# EAGLE board board (EAGLE 9.5.2), part 1 of 2
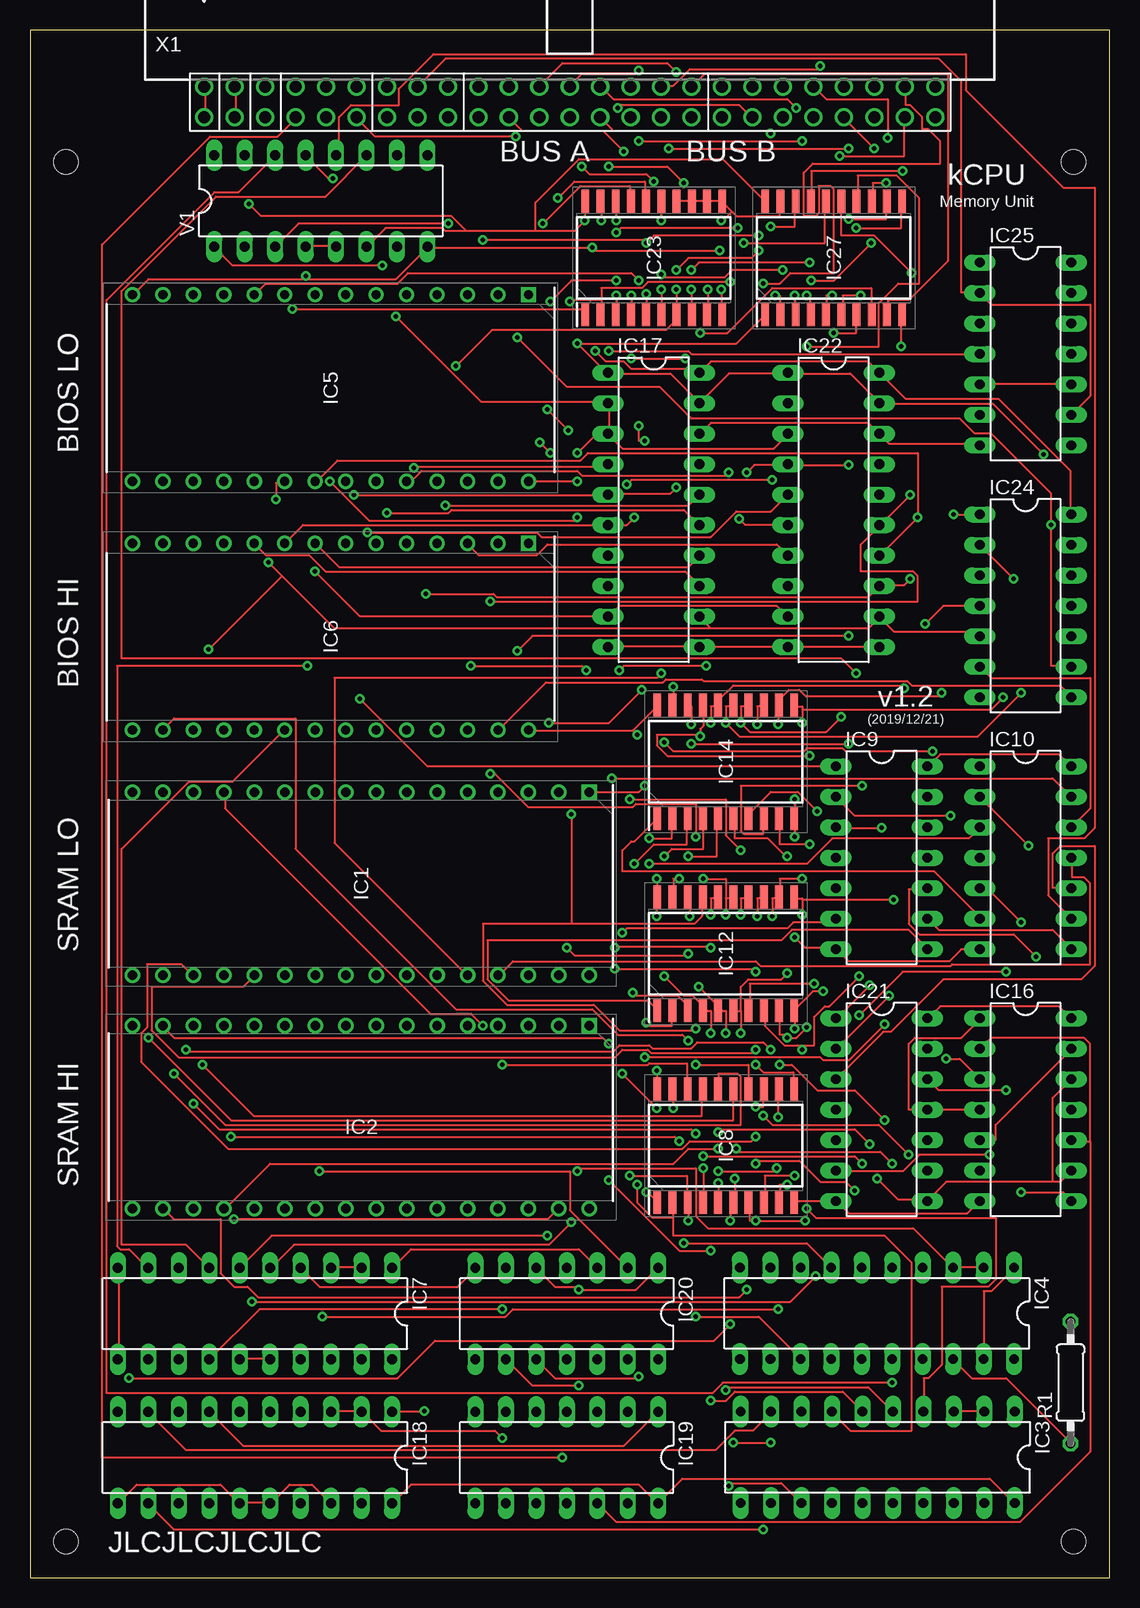
[diagram p3: board, top side]
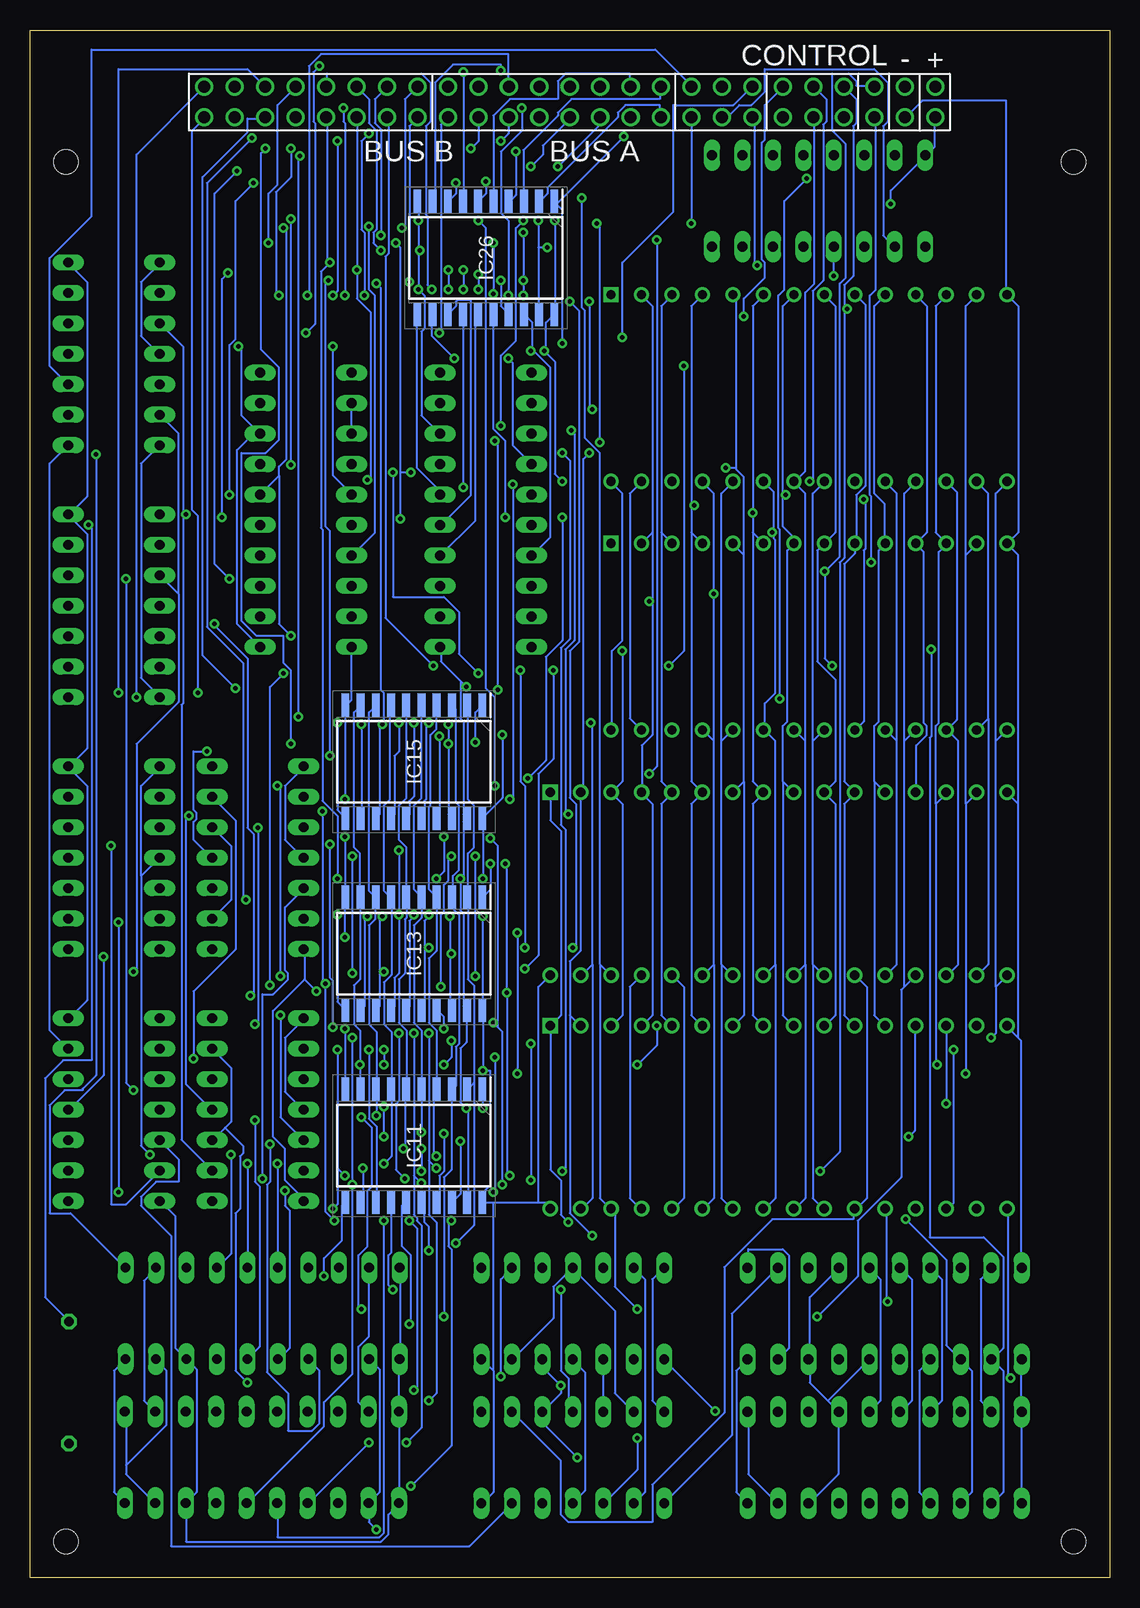
[diagram p4: board, bottom side, seen from below]

Size 90 x 129 mm. Coordinates in mm from the lower left corner, seen from the top.
Outline: 0,0 90,0 90,129 0,129 0,0
Copper layers (1*16): Top 0.035mm / dielectric 1.5mm / Bottom 0.035mm
Design rules "default": minimum track width 6mil, minimum drill 0.35mm, track to track 6mil, track to pad 6mil, pad to pad 6mil, via to via 6mil, smd to smd 6mil, copper to edge 40mil, drill to drill 6mil, minimum pad ring 10mil, minimum via ring 8mil, stop-mask expansion 4mil, vias tented up to drill 0mil, thermal gap 10mil
Holes 2 mm at 3,118 87,118 3,3 87,3

## Footprints (pad centres in the part's own frame; a part is rotated, then mirrored left to right if it is on the bottom)
DIP1524W58P254L4191H406Q32N = drill 0.784 pad 1.184 square: 1 -7.62,19.05 | drill 0.784 pad 1.184: 2 -7.62,16.51; 3 -7.62,13.97; 4 -7.62,11.43; 5 -7.62,8.89; 6 -7.62,6.35; 7 -7.62,3.81; 8 -7.62,1.27; 9 -7.62,-1.27; 10 -7.62,-3.81; 11 -7.62,-6.35; 12 -7.62,-8.89; 13 -7.62,-11.43; 14 -7.62,-13.97; 15 -7.62,-16.51; 16 -7.62,-19.05; 17 7.62,-19.05; 18 7.62,-16.51; 19 7.62,-13.97; 20 7.62,-11.43; 21 7.62,-8.89; 22 7.62,-6.35; 23 7.62,-3.81; 24 7.62,-1.27; 25 7.62,1.27; 26 7.62,3.81; 27 7.62,6.35; 28 7.62,8.89; 29 7.62,11.43; 30 7.62,13.97; 31 7.62,16.51; 32 7.62,19.05
DIL20 = drill 0.813 long: 1 -11.43,-3.81; 2 -8.89,-3.81; 3 -6.35,-3.81; 4 -3.81,-3.81; 5 -1.27,-3.81; 6 1.27,-3.81; 7 3.81,-3.81; 8 6.35,-3.81; 9 8.89,-3.81; 10 11.43,-3.81; 11 11.43,3.81; 12 8.89,3.81; 13 6.35,3.81; 14 3.81,3.81; 15 1.27,3.81; 16 -1.27,3.81; 17 -3.81,3.81; 18 -6.35,3.81; 19 -8.89,3.81; 20 -11.43,3.81
DIP1556W56P254L3702H483Q28N = drill 0.759 pad 1.159 square: 1 -7.779,16.51 | drill 0.759 pad 1.159: 2 -7.779,13.97; 3 -7.779,11.43; 4 -7.779,8.89; 5 -7.779,6.35; 6 -7.779,3.81; 7 -7.779,1.27; 8 -7.779,-1.27; 9 -7.779,-3.81; 10 -7.779,-6.35; 11 -7.779,-8.89; 12 -7.779,-11.43; 13 -7.779,-13.97; 14 -7.779,-16.51; 15 7.779,-16.51; 16 7.779,-13.97; 17 7.779,-11.43; 18 7.779,-8.89; 19 7.779,-6.35; 20 7.779,-3.81; 21 7.779,-1.27; 22 7.779,1.27; 23 7.779,3.81; 24 7.779,6.35; 25 7.779,8.89; 26 7.779,11.43; 27 7.779,13.97; 28 7.779,16.51
SOIC127P1030X265-20N = smd 1.95 x 0.65: 1 -4.725,5.715; 2 -4.725,4.445; 3 -4.725,3.175; 4 -4.725,1.905; 5 -4.725,0.635; 6 -4.725,-0.635; 7 -4.725,-1.905; 8 -4.725,-3.175; 9 -4.725,-4.445; 10 -4.725,-5.715; 11 4.725,-5.715; 12 4.725,-4.445; 13 4.725,-3.175; 14 4.725,-1.905; 15 4.725,-0.635; 16 4.725,0.635; 17 4.725,1.905; 18 4.725,3.175; 19 4.725,4.445; 20 4.725,5.715
DIL14 = drill 0.813 long: 1 -7.62,-3.81; 2 -5.08,-3.81; 3 -2.54,-3.81; 4 0,-3.81; 5 2.54,-3.81; 6 5.08,-3.81; 7 7.62,-3.81; 8 7.62,3.81; 9 5.08,3.81; 10 2.54,3.81; 11 0,3.81; 12 -2.54,3.81; 13 -5.08,3.81; 14 -7.62,3.81
0207/10 = drill 0.813 octagon: 1 -5.08,0; 2 5.08,0
DIL16 = drill 0.813 long: 1 -8.89,-3.81; 2 -6.35,-3.81; 3 -3.81,-3.81; 4 -1.27,-3.81; 5 1.27,-3.81; 6 3.81,-3.81; 7 6.35,-3.81; 8 8.89,-3.81; 9 8.89,3.81; 10 6.35,3.81; 11 3.81,3.81; 12 1.27,3.81; 13 -1.27,3.81; 14 -3.81,3.81; 15 -6.35,3.81; 16 -8.89,3.81
PAK100/2500-5-50 = drill 1 pad 1.422: 1 -30.48,-1.27; 2 -30.48,1.27; 3 -27.94,-1.27; 4 -27.94,1.27; 5 -25.4,-1.27; 6 -25.4,1.27; 7 -22.86,-1.27; 8 -22.86,1.27; 9 -20.32,-1.27; 10 -20.32,1.27; 11 -17.78,-1.27; 12 -17.78,1.27; 13 -15.24,-1.27; 14 -15.24,1.27; 15 -12.7,-1.27; 16 -12.7,1.27; 17 -10.16,-1.27; 18 -10.16,1.27; 19 -7.62,-1.27; 20 -7.62,1.27; 21 -5.08,-1.27; 22 -5.08,1.27; 23 -2.54,-1.27; 24 -2.54,1.27; 25 0,-1.27; 26 0,1.27; 27 2.54,-1.27; 28 2.54,1.27; 29 5.08,-1.27; 30 5.08,1.27; 31 7.62,-1.27; 32 7.62,1.27; 33 10.16,-1.27; 34 10.16,1.27; 35 12.7,-1.27; 36 12.7,1.27; 37 15.24,-1.27; 38 15.24,1.27; 39 17.78,-1.27; 40 17.78,1.27; 41 20.32,-1.27; 42 20.32,1.27; 43 22.86,-1.27; 44 22.86,1.27; 45 25.4,-1.27; 46 25.4,1.27; 47 27.94,-1.27; 48 27.94,1.27; 49 30.48,-1.27; 50 30.48,1.27

## Placement (x,y rotation side)
IC1  AS6C4008-55PCN  [DIP1524W58P254L4191H406Q32N]  27.59,57.84 270 top
IC2  AS6C4008-55PCN  [DIP1524W58P254L4191H406Q32N]  27.59,38.37 270 top
IC3  74S299N  [DIL20]  70.67,10.02 180 top
IC4  74S299N  [DIL20]  70.61,22.02 180 top
IC5  AT28C64B-15PU  [DIP1556W56P254L3702H483Q28N]  25.05,99.15 270 top
IC6  AT28C64B-15PU  [DIP1556W56P254L3702H483Q28N]  25.05,78.43 270 top
IC7  74S299N  [DIL20]  18.75,22 180 top
IC8  SN74CBT3345DW  [SOIC127P1030X265-20N]  58,36 90 top
IC9  7432N  [DIL14]  71,60 270 top
IC10  7432N  [DIL14]  83,60 270 top
IC11  SN74CBT3345DW  [SOIC127P1030X265-20N]  58,36 270 bottom
IC12  SN74CBT3345DW  [SOIC127P1030X265-20N]  58,52 90 top
IC13  SN74CBT3345DW  [SOIC127P1030X265-20N]  58,52 270 bottom
IC14  SN74CBT3345DW  [SOIC127P1030X265-20N]  58,68 90 top
IC15  SN74CBT3345DW  [SOIC127P1030X265-20N]  58,68 270 bottom
IC16  74S08N  [DIL14]  83,39 270 top
IC17  74S299N  [DIL20]  52,89 270 top
IC18  74S299N  [DIL20]  18.75,10 180 top
IC19  7404N  [DIL14]  44.75,10 180 top
IC20  74S08N  [DIL14]  44.75,22 180 top
IC21  74S08N  [DIL14]  71,39 270 top
IC22  74S299N  [DIL20]  67,89 270 top
IC23  SN74CBT3345DW  [SOIC127P1030X265-20N]  52,110 90 top
IC24  7404N  [DIL14]  83,81 270 top
IC25  7486N  [DIL14]  83,102 270 top
IC26  SN74CBT3345DW  [SOIC127P1030X265-20N]  52,110 270 bottom
IC27  SN74CBT3345DW  [SOIC127P1030X265-20N]  67,110 90 top
R1  1k  [0207/10]  86.75,16.25 90 top
V1  74238N  [DIL16]  24.25,114.75 0 top
X1  2550-5  [PAK100/2500-5-50]  45,123 0 top